# Altium schematic sheet 5v_BOOST.SchDoc: Shipwars Boost Schematic
size 431 x 279 mm; CheckedBy: SP, PS; Author: SP, PS; CompanyName: UPenn; DrawnBy: SP, PS; Engineer: SP, PS; Organization: UPenn; Address1: 200 S 33rd Street; Address2: Detkin Lab; Address3: Philadelphia; Address4: PA 19104; Revision: .1.0.0; SheetNumber: 6; SheetTotal: 10; Project: Shipwars
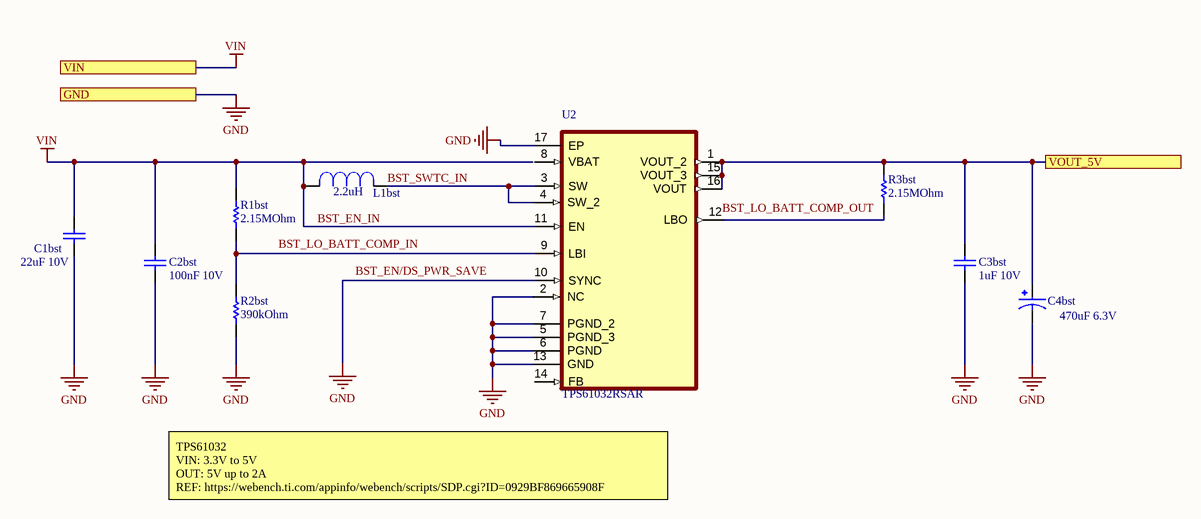
[diagram p0: 5v_BOOST.SchDoc]

## Parts
C1bst  22uF 10V  [CAPC1608X100X20ML10]
C2bst  100nF 10V  [CAPC1005X55X25LL05T10]
C3bst  1uF 10V  [CAPC1608X90X35LL15T15]
C4bst  470uF 6.3V  [6TPB470M]
L1bst  2.2uH  [DR127-2R2-R]
R1bst  2.15MOhm  [RESC1005X40X25LL05T05]
R2bst  390kOhm  [RESC0603(1608)_L]
R3bst  2.15MOhm  [RESC1005X40X25LL05T05]
U2  TPS61032RSAR  [TPS61032RSAR]

## Ports
GND, VIN, VOUT_5V

## Nets
BST_EN_IN: C1bst.2 C2bst.2 L1bst.2 R1bst.2 U2.11(EN) ; port VIN  [also labelled VIN]
GND: C1bst.1 C2bst.1 C3bst.1 C4bst.2 R2bst.1 U2.2(NC) U2.5(PGND_3) U2.6(PGND) U2.7(PGND_2) U2.10(SYNC) U2.13(GND) U2.17(EP) ; port GND
BST_SWTC_IN: L1bst.1 U2.3(SW) U2.4(SW_2)
VOUT_5V: C3bst.2 C4bst.1 R3bst.2 U2.1(VOUT_2) U2.15(VOUT_3) U2.16(VOUT) ; port VOUT_5V
NetR1bst_1: R1bst.1 R2bst.2 U2.9(LBI)
NetR3bst_1: R3bst.1 U2.12(LBO)

Not connected (* = marked no-connect by the designer): U2 8(VBAT) 14(FB)

## Notes on the sheet
- (near U2) TPS61032
  VIN: 3.3V to 5V
  OUT: 5V up to 2A
  REF: https://webench.ti.com/appinfo/webench/scripts/SDP.cgi?ID=0929BF869665908F
- Labels drawn without touching a wire or pin: BST_EN/DS_PWR_SAVE, BST_LO_BATT_COMP_IN, BST_LO_BATT_COMP_OUT
- DWG. NO.
- REV.
- SHT.
- THIS DOCUMENT AND THE DATA DISCLOSED HEREIN OR HEREWITH IS THE PROPERTY OF ALTIUM LIMITED AND MAY BE FREELY DISTRIBUTED IN WHOLE. NO RIGHTS ARE RESERVED OR EXPRESS OR IMPLIED WARANTEE GIVEN.
- REVISION
- DESCRIPTION
- DATE
- APPROVED
- ENG:
- APPROVALS
- PROJECT
- DSN:
- CHK:
- REFERENCE DOCUMENTS
- PROJECT REVISION:
- TITLE
- DOCUMENT REVISION:
- DESIGN ITEM:
- BOM:
- FAB DWG:
- PCB DWG:
- ASSY DWG:
- SCALE:
- SIZE
- B
- CAGE CODE
- FILE NAME
- DWG NO.
- SHEET
- OF
- REV

## Library data of the parts
C1bst = CMP-2000-05441-1: Chip Capacitor, 22 uF, +/- 20%, 10 V, -55 to 85 degC, 0603 (1608 Metric), RoHS, Tape and Reel; Manufacturer: TDK; PCN Part Number: MLCCPartNumberChange30/Nov/2012; Product Training Modules: CSeriesGeneralApplicationsSEAT,CCV,andTVCLDesignToolsGuidetoReplacinganElectrolyticCapacitorwithanMLCC; Other Names: 445-9077-1; Design Resources: 20WNon-IsolatedBuckLEDDriverUsingPLLNK460KG; Online Catalog: CSeries,GeneralPurpose; Capacitance: 22µF; Temperature Coefficient: X5R; Kits: 445-9014-KIT-ND-KITMLCC100PF-22UF060310-50V; Packaging: CutTape(CT); Standard Package: 1; Package / Case: 0603(1608Metric); Lead Style: -; Features: -; Ratings: -; Voltage - Rated: 10V; Operating Temperature: -55degC~85degC; Applications: GeneralPurpose; Package Reference: 603; Datasheet URL: http://download.siliconexpert.com/pdfs/2015/4/21/15/54/45/779/tdk_/manual/37024850441143360mlcc_commercial_general_en.pdf; Datasheet Version: Mar-15; Mounting Type: SurfaceMount,MLCC; Lead Spacing: -; Height - Seated (Max): -; Package Description: 2-Pin Surface Mount Device, Body 1.6 x 0.8 mm; Manufacturer URL: http://www.tdk.com/; RoHS Information: RoHSCertificate-MLCC; Tolerance: ±20%; Series: C; Family: CeramicCapacitors; Category: Capacitors
C2bst = CMP-2000-06331-1: Chip Capacitor, 0.1 uF, +/- 10%, 10 V, -55 to 125 degC, 0402 (1005 Metric), RoHS, Tape and Reel GRM155R71A104KA01D; Manufacturer: Murata; Capacitance: 100000pF; Dielectric: X7R; Rated Voltage: 10V; Manufacturer URL: http://www.murata.com/; Datasheet Version: 02/2016; Datasheet URL: http://search.murata.co.jp/Ceramy/image/img/A01X/G101/ENG/GRM155R71A104KA01-01.pdf; Package Reference: 0402; Tolerance (%): ±10%; Package Description: 2-Pin Surface Mount Device, Body 1 x 0.5 mm; Mounting Technology: SurfaceMount; Case Size/Dimension: 0402
C3bst = CMP-2006-02257-1: 0603(1608) C0603C105K8PACTU; Manufacturer: Kemet; Part Number: C0603C105K8PACTU
C4bst = 6TPB470M: Cap Tant Solid 470uF 6.3V D4 CASE 20% (7.3 X 4.3 X 3.8mm) 2917(7343) SMD 7343 0.035 Ohm 105 C Embossed T/R 6TPB470M; Manufacturer: Panasonic; Material: Polymer; ESR (Equivalent Series Resistance): 35mR; Leakage Current: 296.1uA; Polarity: Polar; Dissipation Factor: 15%; Ripple Current: 3A; Package: None; MP: 6TPB470M; Price: None; Value: *; Availability: Unavailable; Supplier 1: Digi-Key; Supplier Part Number 1: P16619CT-ND; Manufacturer Part Number: 6TPB470M; RoHS: Yes; Category: Tantalum Capacitors; Stock 1: 1296; Pricing 1: 1=2.80000, 10=2.26600, 50=1.97800, 100=1.73070, 500=1.31860, 1000=1.15378 (USD); Mount: Surface Mount; Case/Package: 2917; Number of Pins: 4; Case Code (Imperial): 2917; Case Code (Metric): 7343; Min Operating Temperature: -55°C; Max Operating Temperature: 105°C; Tolerance: 20%; Capacitance: 470uF; Packaging: Tape and Reel; Voltage Rating: 6.3V; Voltage Rating (DC): 6.3V; Termination: SMD/SMT; Package Quantity: 2000; Voltage: 6.3V; Length: 7.3mm; Width: 4.3mm; Height: 3.8mm; Depth: 4.3mm; Height - Seated (Max): 0.157inch; Radiation Hardening: No; REACH SVHC: No SVHC; Lead Free: Lead Free; RoHS Compliant: Yes; ComponentLink1URL: https://datasheet.ciiva.com/48675/aaa8000ce6-48675082.pdf?src-supplier=Avnet; ComponentLink1Description: https://datasheet.ciiva.com/48675/aaa8000ce6-48675082.pdf?src-supplier=Avnet; ComponentLink2URL: https://datasheet.ciiva.com/26840/getdatasheetpartid-747821-26840892.pdf?src-supplier=Verical; ComponentLink2Description: https://datasheet.ciiva.com/26840/getdatasheetpartid-747821-26840892.pdf?src-supplier=Verical; ComponentLink3URL: https://datasheet.ciiva.com/22745/1734361-22745321.pdf?src-supplier=Element14; ComponentLink3Description: https://datasheet.ciiva.com/22745/1734361-22745321.pdf?src-supplier=Element14
L1bst = DR127-2R2-R: Ind Power Shielded Wirewound 2.2uH 20% 100KHz Ferrite 12.5A T/R DR127-2R2-R; Manufacturer: Eaton Cooper; MF: Eaton; Max DC Current: 25.5A; DC Resistance (DCR): 4.02mR; Price: None; SnapEDA_Link: https://www.snapeda.com/parts/DR127-2R2-R/Eaton/view-part/498534/?ref=snap; MP: DR127-2R2-R; Value: *; Mouser-Purchase-URL: https://snapeda.com/shop?store=Mouser&id=498534; Availability: Warning; Package: Nonstandard Coiltronics; DigiKey-Purchase-URL: https://snapeda.com/shop?store=DigiKey&id=498534; Supplier 1: Digi-Key; Supplier Part Number 1: 513-1220-1-ND; Manufacturer Part Number: DR127-2R2-R; RoHS: Yes; Category: Fixed Inductors; Stock 1: 200; Pricing 1: 1=1.50000, 10=1.39400, 25=1.28720, 50=1.07240, 100=1.00820 (USD); Mount: Surface Mount; Case/Package: Nonstandard; Core Material: Ferrite; Weight: 0.208oz; Min Operating Temperature: -40°C; Max Operating Temperature: 125°C; Tolerance: 20%; Inductance: 2.2uH; Inductance Tolerance: 20%; Packaging: Tape and Reel; Shielding: Shielded; Package Quantity: 350; Current Rating: 12.5A; Saturation Current: 25.5A; Resistor Type: Wirewound; Test Frequency: 100kHz; Termination: SMD/SMT; RMS Current (Irms): 12.5A; DC Current: 12.5A; Self Resonant Frequency: 100kHz; Series: DR; Rated Current-Max: 12.5A; Length: 12.5mm; Width: 0.492inch; Height: 8mm; Height - Seated (Max): 0.315inch; Depth: 12.5mm; Radiation Hardening: No; REACH SVHC: No SVHC; Military Standard: Not; Lead Free: Lead Free; ComponentLink1URL: https://datasheet.ciiva.com/14667/0900766b8116a153-14667792.pdf?src-supplier=RSComponents; ComponentLink1Description: https://datasheet.ciiva.com/14667/0900766b8116a153-14667792.pdf?src-supplier=RSComponents; ComponentLink2URL: https://datasheet.ciiva.com/26858/getdatasheetpartid-246998-26858414.pdf?src-supplier=Verical; ComponentLink2Description: https://datasheet.ciiva.com/26858/getdatasheetpartid-246998-26858414.pdf?src-supplier=Verical; ComponentLink3URL: https://datasheet.ciiva.com/30226/43bus-elx-ds-4315-dr-ser-30226599.pdf?src-supplier=Onlinecomponents.com; ComponentLink3Description: https://datasheet.ciiva.com/30226/43bus-elx-ds-4315-dr-ser-30226599.pdf?src-supplier=Onlinecomponents.com; ComponentLink4URL: https://datasheet.ciiva.com/8004/87246-8004873.pdf?src-supplier=Element14; ComponentLink4Description: https://datasheet.ciiva.com/8004/87246-8004873.pdf?src-supplier=Element14; ComponentLink5URL: https://datasheet.ciiva.com/16226/bus-elx-ds-4315-dr-series-16226311.pdf?src-supplier=Future+Electronics; ComponentLink5Description: https://datasheet.ciiva.com/16226/bus-elx-ds-4315-dr-series-16226311.pdf?src-supplier=Future+Electronics; ComponentLink6URL: https://datasheet.ciiva.com/16940/70037876-16940757.pdf?src-supplier=Allied+Electronics; ComponentLink6Description: https://datasheet.ciiva.com/16940/70037876-16940757.pdf?src-supplier=Allied+Electronics
R1bst = CMP-2002-00322-1: 1% 0402(1005)CRCW04022M15FKED; Manufacturer: Vishay Dale; Part Number: CRCW04022M15FKED
R2bst = CMP-1012-00802-1: 390K 0.1W 1% 0603 (1608 Metric)  SMD; Case-EIA: 0603; Case-Metric: 1608; Value: 390000.00 Ohm; Power: 0.1 W; Technology: SMT; Tolerance: 1 %
R3bst = CMP-2002-00322-1: 1% 0402(1005) CRCW04022M15FKED; Manufacturer: Vishay Dale; Part Number: CRCW04022M15FKED
U2 = TPS61032RSAR: 5-V Output, 1-A, 96% Efficient Boost Converter w/20uA Iq in TSSOP-16 16-QFN -40 to 85; Manufacturer: Texas Instruments; Number of Outputs: 1; Output Voltage: 5V; Output Current: 1A; Min Input Voltage: 1.8V; Max Input Voltage: 5.5V; Switching Frequency: 600kHz; Synchronous Rectifier: Yes; Quiescent Current: 20uA; Output Type: Fixed; Output Configuration: Positive; Supplier 1: Digi-Key; Manufacturer Part Number: TPS61032RSAR; RoHS: Yes; Category: Voltage Regulators - Switching; Stock 1: 952; Pricing 1: 1=3.13000, 10=2.80800, 25=2.65440, 100=2.30060, 250=2.18260, 500=1.95844, 1000=1.94775 (USD); Mount: Surface Mount; Case/Package: VQFN; Number of Pins: 16; Weight: 0.001464oz; Min Operating Temperature: -40°C; Max Operating Temperature: 85°C; Efficiency: 96%; Packaging: Tape and Reel; Package Quantity: 1; Max Output Current: 1A; Topology: Boost; Operating Supply Voltage: 5.5V; Series: -; Min Output Voltage: 5V; Nominal Output Voltage: 5V; Width: 4mm; Radiation Hardening: No; Lead Free: Lead Free; RoHS Compliant: Yes; REACH SVHC: No SVHC; ComponentLink1URL: https://datasheet.ciiva.com/15113/getdatasheetpartid-188315-15113727.pdf?src-supplier=Verical; ComponentLink1Description: https://datasheet.ciiva.com/15113/getdatasheetpartid-188315-15113727.pdf?src-supplier=Verical; ComponentLink2URL: https://datasheet.ciiva.com/26896/tps61032rsar-26896598.pdf?src-supplier=IIIC; ComponentLink2Description: https://datasheet.ciiva.com/26896/tps61032rsar-26896598.pdf?src-supplier=IIIC; ComponentLink3URL: https://datasheet.ciiva.com/2026/tps61030-2026189.pdf?src-supplier=Digi-Key; ComponentLink3Description: https://datasheet.ciiva.com/2026/tps61030-2026189.pdf?src-supplier=Digi-Key; ComponentLink4URL: https://datasheet.ciiva.com/2026/tps61030-2026190.pdf?src-supplier=Digi-Key; ComponentLink4Description: https://datasheet.ciiva.com/2026/tps61030-2026190.pdf?src-supplier=Digi-Key; ComponentLink5URL: https://datasheet.ciiva.com/2026/tps61030-2026191.pdf?src-supplier=Digi-Key; ComponentLink5Description: https://datasheet.ciiva.com/2026/tps61030-2026191.pdf?src-supplier=Digi-Key; ComponentLink6URL: https://datasheet.ciiva.com/22684/1902788-22684647.pdf?src-supplier=Element14; ComponentLink6Description: https://datasheet.ciiva.com/22684/1902788-22684647.pdf?src-supplier=Element14